# Altium schematic sheet battery.SchDoc
size A3
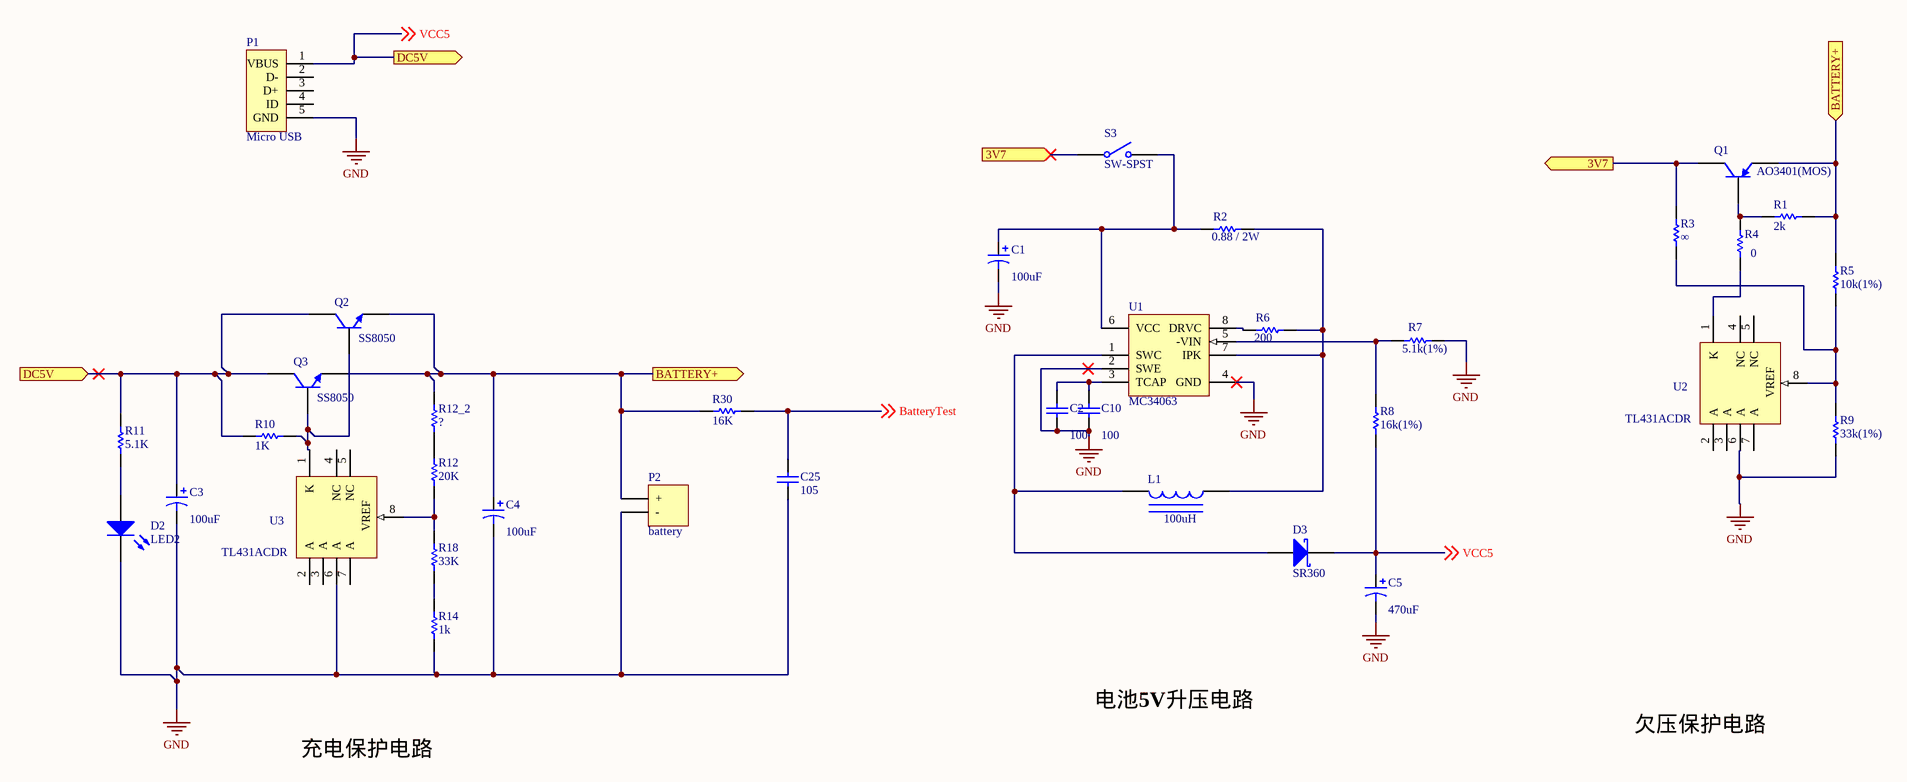
[diagram p0: battery.SchDoc]

## Parts
C1  value 100uF  [cap_al]  (hidden comment: Cap Pol1)
C2  value 100  [C0805]  (hidden comment: Cap)
C3  value 100uF  [cap_al]  (hidden comment: Cap Pol1)
C4  value 100uF  [cap_al]  (hidden comment: Cap Pol1)
C5  value 470uF  [CD5]  (hidden comment: Cap Pol1)
C10  value 100  [C0805]  (hidden comment: Cap)
C25  value 105  [C0805]  (hidden comment: Cap)
D2  LED2  [HDR1X2]
D3  SR360  [SMB]
L1  value 100uH  [INDC]  (hidden comment: Inductor Iron)
P1  Micro USB  [MICRO-USB]
P2  battery  [HDR1X2]
Q1  AO3401(MOS)  [SOT-23B_N]
Q2  SS8050  [SOT-23_N]
Q3  SS8050  [SOT-23_N]
R1  value 2k  [6-0805_N]  (hidden comment: Res1)
R2  value 0.88 / 2W  [AXIAL-0.8]  (hidden comment: Res1)
R3  value ∞  [6-0805_N]  (hidden comment: Res1)
R4  value 0  [6-0805_N]  (hidden comment: Res1)
R5  value 10k(1%)  [6-0805_N]  (hidden comment: Res1)
R6  value 200  [6-0805_N]  (hidden comment: Res1)
R7  value 5.1k(1%)  [6-0805_N]  (hidden comment: Res1)
R8  value 16k(1%)  [6-0805_N]  (hidden comment: Res1)
R9  value 33k(1%)  [6-0805_N]  (hidden comment: Res1)
R10  value 1K  [6-0805_N]  (hidden comment: Res1)
R11  value 5.1K  [6-0805_N]  (hidden comment: Res1)
R12  value 20K  [6-0805_N]  (hidden comment: Res1)
R12_2  Res1  [6-0805_N]  (value not drawn)
R14  value 1k  [6-0805_N]  (hidden comment: Res1)
R18  value 33K  [6-0805_N]  (hidden comment: Res1)
R30  value 16K  [6-0805_N]  (hidden comment: Res1)
S3  SW-SPST  [HDR1X2]
U1  MC34063  [751-02_N]
U2  TL431ACDR  [D008_N]
U3  TL431ACDR  [D008_N]

## Ports
3V7 (in), 3V7 (out), BATTERY+ (in), BATTERY+ (out), DC5V (in), DC5V (out)

## Nets
GND: C1.2 C2.1 C3.2 C4.2 C5.2 C10.1 C25.1 D2.2(K) P1.5(GND) P2.2(-) R7.2 R9.1 R14.2 U1.2(SWE) U1.4(GND) U2.6(A) U3.6(A)
3V7: Q1.1(C) R3.2 S3.1(COMMON) ; port 3V7
BATTERY+: C4.1 P2.1(+) Q1.3(E) Q2.3(E) Q3.3(E) R1.1 R5.2 R12_2.1 R30.2 ; port BATTERY+
BatteryTest: C25.2 R30.1 ; off-sheet BatteryTest
VCC5: C3.1 C5.1 D3.2(K) P1.1(VBUS) Q2.1(C) Q3.1(C) R8.1 R10.2 R11.1 ; off-sheet VCC5, port DC5V
NetC1_1: C1.1 R2.1 S3.2(NO) U1.6(VCC)
NetC2_2: C2.2 C10.2 U1.3(TCAP)
NetD2_1: D2.1(A) R11.2
NetD3_1: D3.1(A) L1.2 U1.1(SWC)
NetL1_1: L1.1 R2.2 R6.2 U1.7(IPK)
NetQ1_2: Q1.2(B) R1.2 R4.2
NetQ2_2: Q2.2(B) Q3.2(B) R10.1 U3.1(K)
NetR3_1: R3.1 R5.1 R9.2 U2.8(VREF)
NetR4_1: R4.1 U2.1(K)
NetR6_1: R6.1 U1.8(DRVC)
NetR7_1: R7.1 R8.2 U1.5(-VIN)
NetR12_1: R12.1 R12_2.2
NetR12_2: R12.2 R18.1 U3.8(VREF)
NetR14_1: R14.1 R18.2

Not connected (* = marked no-connect by the designer): P1 2(D-) 3(D+) 4(ID); U2 2(A) 3(A) 4(NC) 5(NC) 7(A); U3 2(A) 3(A) 4(NC) 5(NC) 7(A)

## Notes on the sheet
- 电池5V升压电路
- 充电保护电路
- 欠压保护电路

## Library data of the parts
C1 C3-C5 = Cap Pol1: Polarized Capacitor (Radial); Published: 8-Jun-2000; LatestRevisionDate: 17-Jul-2002; LatestRevisionNote: Re-released for DXP Platform.; PackageReference: RB7.6-15; Publisher: Altium Limited; PackageDescription: Polarized Capacitor (Radial); 2 Leads
C2 C10 C25 = Cap: Capacitor; Published: 8-Jun-2000; LatestRevisionDate: 17-Jul-2002; LatestRevisionNote: Re-released for DXP Platform.; PackageReference: RAD-0.3; Publisher: Altium Limited; PackageDescription: Radial Cap, Thru-Hole; 2 Leads; 0.3 in Pin Spacing
D2 = LED2: Typical RED, GREEN, YELLOW, AMBER GaAs LED; Published: 8-Jun-2000; LatestRevisionDate: 17-Jul-2002; LatestRevisionNote: Re-released for DXP Platform.; PackageVersion: Feb-2002; PackageReference: 3.2X1.6X1.1; Publisher: Altium Limited; PackageDescription: SM LED; 2 Flat Leads
D3 = D Schottky: Schottky Diode; Published: 8-Jun-2000; LatestRevisionDate: 17-Jul-2002; LatestRevisionNote: Re-released for DXP Platform.; PackageReference: SMB; Publisher: Altium Limited; PackageDescription: DO-214-AA/SMB; 2 C-Bend Leads; Body 5.3 x 3.6 mm, inc. leads (LxW); Code_JEDEC: DO-214-AA
L1 = Inductor Iron: Magnetic-Core Inductor; Published: 24-Mar-1999; LatestRevisionDate: 17-Jul-2002; LatestRevisionNote: Re-released for DXP Platform.; PackageReference: AXIAL-0.9; Publisher: Altium Limited; PackageDescription: Axial Device, Thru-Hole; 2 Leads; 0.9 in Pin Spacing
P1 = Header 5: Header, 5-Pin; LatestRevisionDate: 17-Jul-2002; LatestRevisionNote: Re-released for DXP Platform.; Publisher: Altium Limited
P2 = Header 2: Header, 2-Pin; LatestRevisionDate: 17-Jul-2002; LatestRevisionNote: Re-released for DXP Platform.; Publisher: Altium Limited
Q1 = PNP: PNP Bipolar Transistor; pin to pad: 1>3 2>1 3>2; Published: 8-Jun-2000; LatestRevisionDate: 29-May-2009; LatestRevisionNote: IPC-7351 Footprint Added.; PackageVersion: Aug-1999; PackageReference: SOT-23B; Publisher: Altium Limited; PackageDescription: 3-Pin SOT-23 Package 0.95 mm Pitch, 2.4 mm Lead Span
Q2 Q3 = NPN: NPN Bipolar Transistor; pin to pad: 1>3 2>1 3>2; Published: 8-Jun-2000; LatestRevisionDate: 17-Jul-2002; LatestRevisionNote: Re-released for DXP Platform.; PackageReference: TO-226-AA; Publisher: Altium Limited; PackageDescription: TO, Flat Index; 3 In-Line, Axial Leads; Body Dia. 4.8mm; Leads 0.55 x 0.51 mm (max); Code_JEDEC: TO-226-AA
R1-R12 R12_2 R14 R18 R30 = Res1: Resistor; Published: 8-Jun-2000; LatestRevisionDate: 17-Jul-2002; LatestRevisionNote: Re-released for DXP Platform.; PackageReference: AXIAL-0.3; Publisher: Altium Limited; PackageDescription: Axial Device, Thru-Hole; 2 Leads; 0.3 in Pin Spacing
  R12_2: Value: ?
S3 = SW-SPST: Single-Pole, Single-Throw Switch; Published: 24-Mar-1999; LatestRevisionDate: 17-Jul-2002; LatestRevisionNote: Re-released for DXP Platform.; PackageReference: SPST-2; Publisher: Altium Limited; PackageDescription: Switch; 2 Leads
U1 = MC34063AD: DC-to-DC Converter Control Circuit; Published: 17-Jul-2002; LatestRevisionDate: 13-Apr-2006; LatestRevisionNote: IPC-7351 Footprint Added.; DatasheetVersion: 1988; PackageReference: 751-02; Publisher: Altium Limited; PackageDescription: 8-Pin Small Outline Integrated Circuit 1.27 mm Pitch; Code_JEDEC: MS-012-AA; Code_IPC: SOIC127P600-8; ComponentLink1Description: Manufacturer Link; ComponentLink1URL: http://www.onsemi.com/site/products/taxonomy/0,4438,503,00.html; ComponentLink2Description: Datasheet; ComponentLink2URL: http://www.onsemi.com/pub/Collateral/MC34063A-D.PDF
U2 U3 = TL431ACDR: Adjustable Precision Shunt Regulator; Published: 15-Apr-2002; LatestRevisionDate: 13-Apr-2006; LatestRevisionNote: IPC-7351 Footprint Added.; DatasheetVersion: Oct-2000; PackageVersion: Jan-1998; PackageReference: D008; Publisher: Altium Limited; PackageDescription: 8-Pin Small Outline Integrated Circuit 1.27 mm Pitch; Code_IPC: SOIC127P600-8; ComponentLink1Description: Manufacturer Link; ComponentLink1URL: http://www.ti.com/; ComponentLink2Description: Datasheet; ComponentLink2URL: http://www-s.ti.com/sc/ds/tl431a.pdf